# Altium project 150W Studio Light.PrjPcb
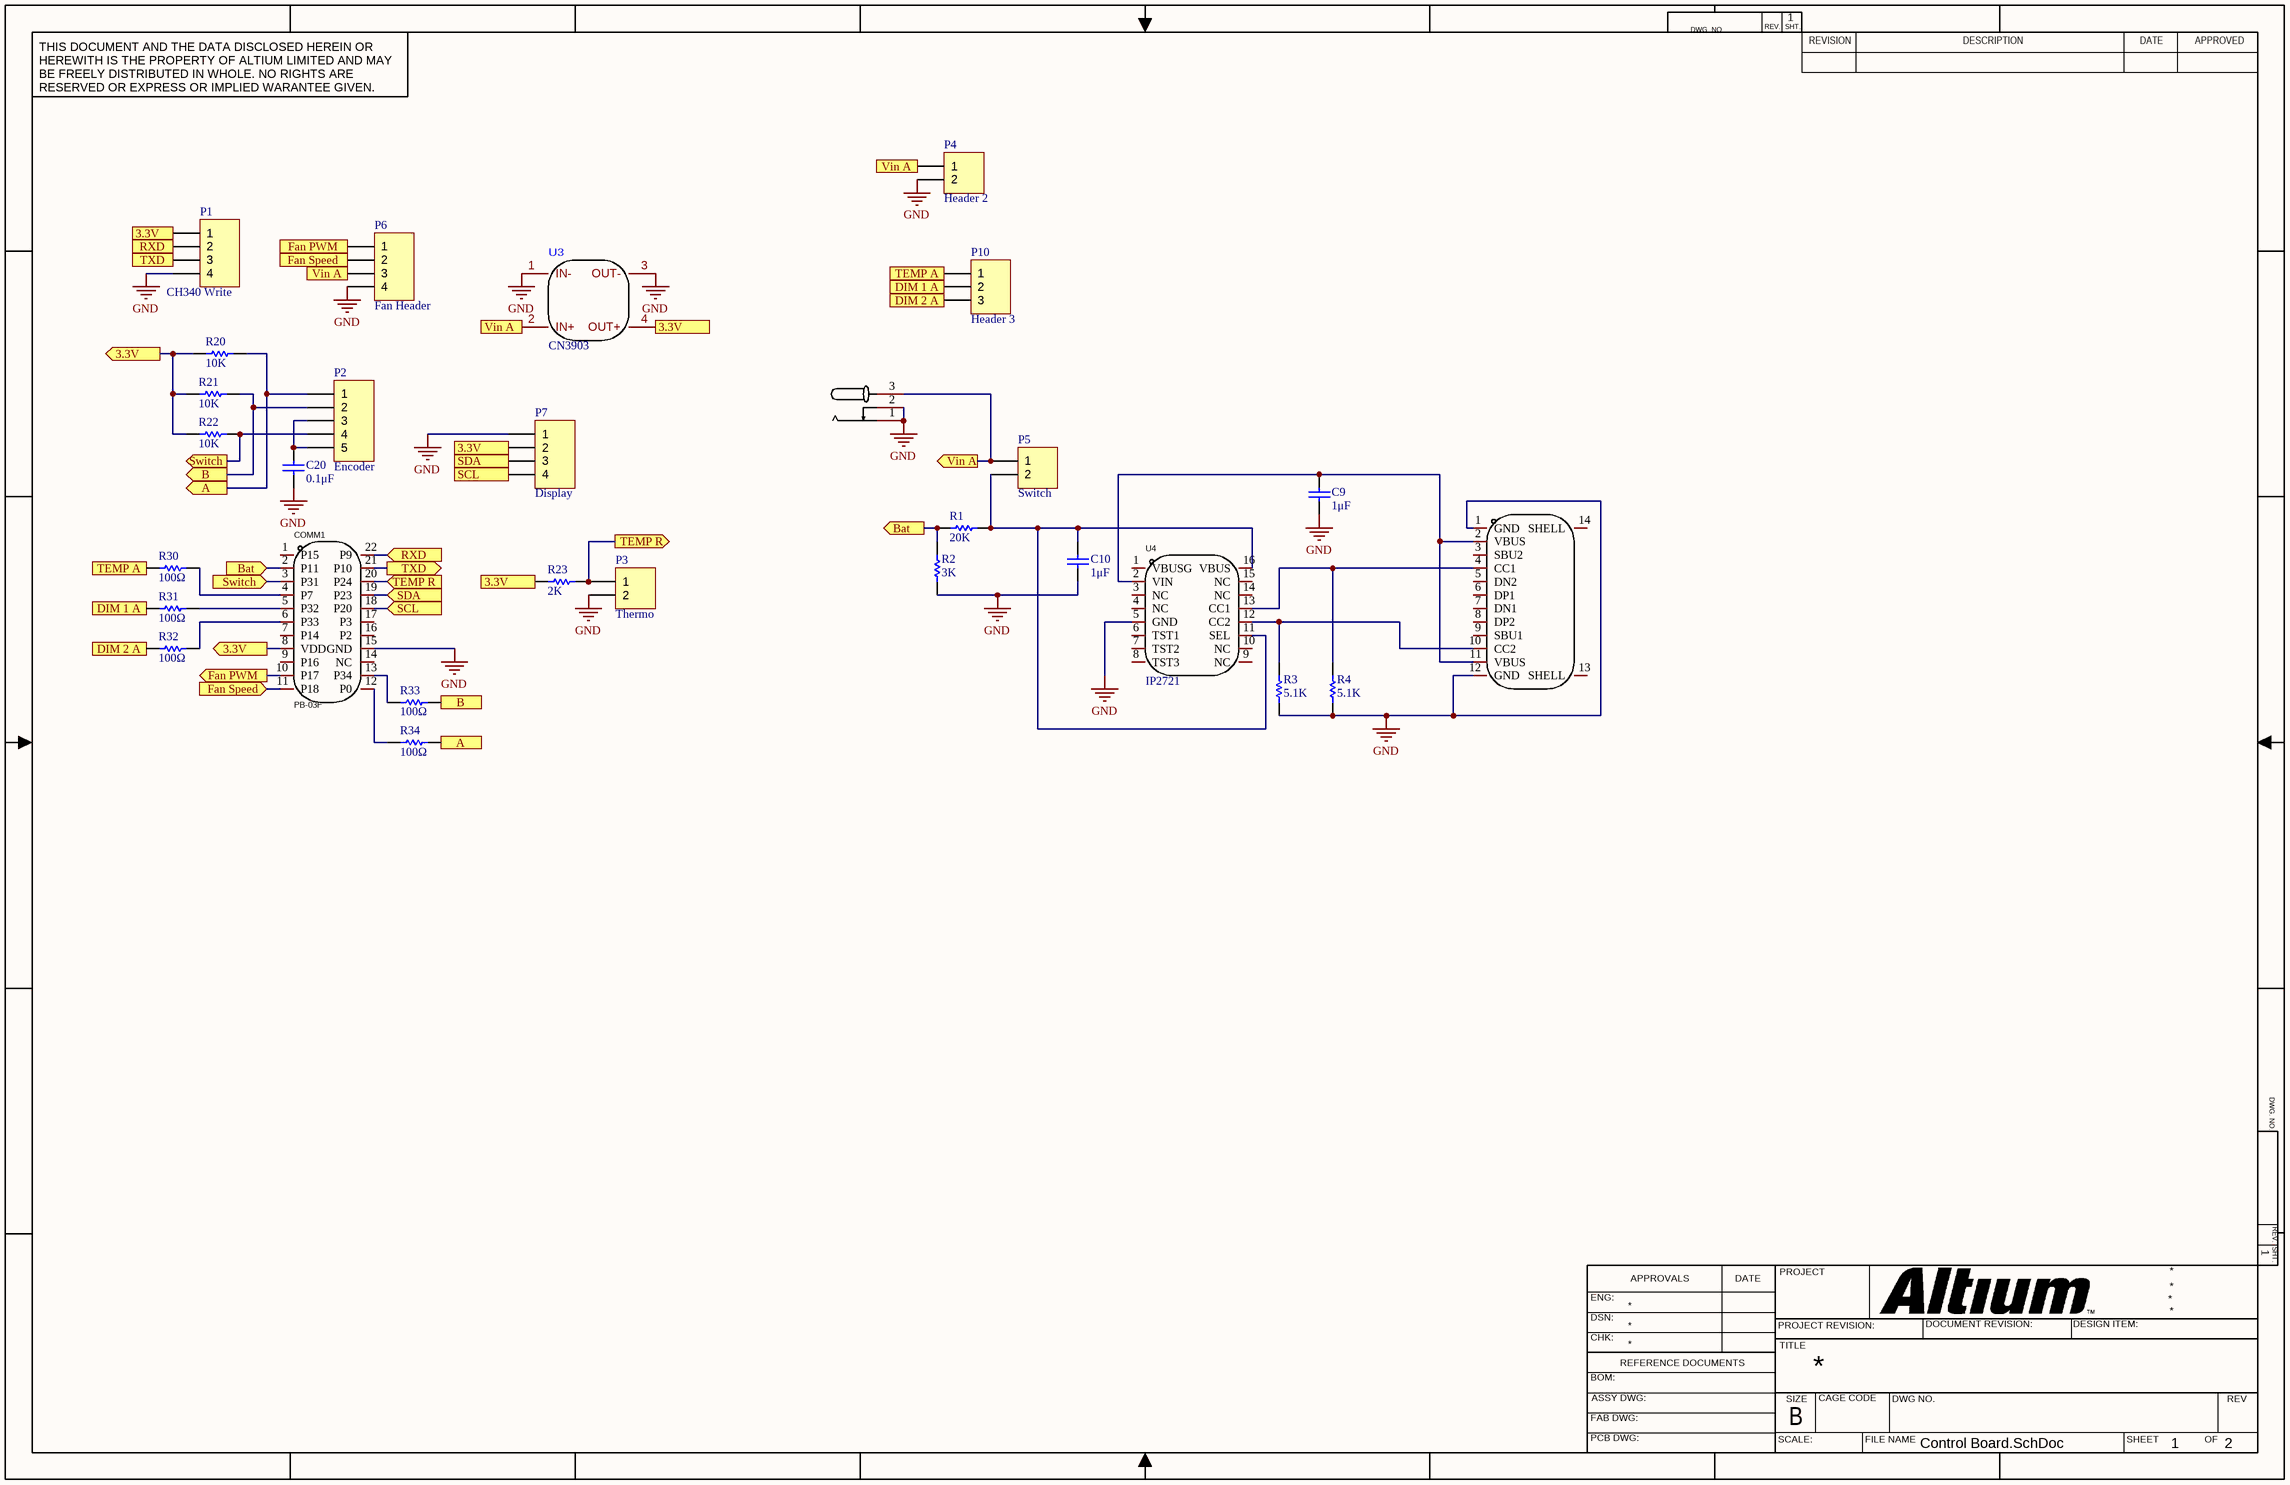
[diagram p0: Control Board.SchDoc]
2 sheets, 75 parts. Net scope: flat (ports and power ports of the same name join across sheets).
Board files: Control Board.PcbDoc, DualLEDDriver.PcbDoc
Sheets:
  Control Board.SchDoc
  DualLEDDriver.SchDoc

## Sheet Control Board.SchDoc
size 431 x 279 mm; SheetNumber: 1; SheetTotal: 2; SPICEModelCacheDHLYHQXB: <root> / <DocumentId>DHLYHQXB</DocumentId> / <CacheFrame Number="0"> / <Model Name="cap" Kind="MDL"> / <Text>*Default semiconductor capacitor / .MODEL CAP C()</Text> / </Model> / </CacheFrame> / </root>

### Parts
C9  value 1μF  [C0805]  (hidden comment: Cap)
C10  value 1μF  [C0805]  (hidden comment: Cap)
C20  value 0.1μF  [C0805]  (hidden comment: Cap)
COMM1  PB-03F  [BULETM-SMD_PB-03F]
DC1  DC-042C-Z-2.5-A  [DC-IN-TH_DC-042C-Z-2.5-A]  (value not drawn)
P1  CH340 Write  [HDR1X4]
P2  Encoder  [HDR1X5]
P3  Thermo  [HDR1X2]
P4  Header 2  [HDR1X2]
P5  Switch  [HDR1X2]
P6  Fan Header  [HDR1X4]
P7  Display  [HDR1X4]
P10  Header 3  [HDR1X3]
R1  value 20K  [C0805]  (hidden comment: Res1)
R2  value 3K  [C0805]  (hidden comment: Res1)
R3  value 5.1K  [C0805]  (hidden comment: Res1)
R4  value 5.1K  [C0805]  (hidden comment: Res1)
R20  value 10K  [C0805]  (hidden comment: Res1)
R21  value 10K  [C0805]  (hidden comment: Res1)
R22  value 10K  [C0805]  (hidden comment: Res1)
R23  value 2K  [C0805]  (hidden comment: Res1)
R30  value 100Ω  [C0805]  (hidden comment: Res1)
R31  value 100Ω  [C0805]  (hidden comment: Res1)
R32  value 100Ω  [C0805]  (hidden comment: Res1)
R33  value 100Ω  [C0805]  (hidden comment: Res1)
R34  value 100Ω  [C0805]  (hidden comment: Res1)
U3  Device: CN3903  [PCBComponent_1 - duplicate]
U4  IP2721  [TSSOP-16_L5.0-W4.4-P0.65-LS6.4-BL]
USB1  TYPE-C 16PIN 2MD(073)  [USB-C-SMD_TYPE-C-6PIN-2MD-073]  (value not drawn)

### Ports
3.3V (out), A (in), A (out), B (in), B (out), Bat (in), Bat (out), DIM 1 A (in), DIM 1 A (out), DIM 2 A (in), DIM 2 A (out), Fan PWM (in), Fan PWM (out), Fan Speed (in), Fan Speed (out), RXD (in), RXD (out), SCL (in), SCL (out), SDA (in), SDA (out), Switch (in), Switch (out), TEMP A (in), TEMP A (out), TEMP R (in), TEMP R (out), TXD (in), TXD (out), Vin A (in), Vin A (out)

### Nets
GND: C9.2 C10.2 C20.1 COMM1.15(GND) DC1.1 DC1.2 P1.4 P3.2 P4.2 P6.4 P7.1 R2.1 R3.2 R4.2 U3.1(IN-) U3.3(OUT-) U4.5(GND) USB1.1(GND) USB1.12(GND)
NetC9_1: C9.1 U4.2(VIN) USB1.2(VBUS) USB1.11(VBUS)
NetC10_1: C10.1 P5.2 R1.2 U4.11(SEL) U4.16(VBUS)
NetC20_2: C20.2 P2.3 P2.5
NetCOMM1_2: COMM1.2(P11) R1.1 R2.2 ; port Bat
NetCOMM1_3: COMM1.3(P31) P2.4 R22.2 ; port Switch
NetCOMM1_4: COMM1.4(P7) R30.2
NetCOMM1_5: COMM1.5(P32) R31.2
NetCOMM1_6: COMM1.6(P33) R32.2
NetCOMM1_8: COMM1.8(VDD) P1.1 P7.2 R20.1 R21.1 R22.1 R23.2 U3.4(OUT+) ; port 3.3V
NetCOMM1_10: COMM1.10(P17) P6.1 ; port Fan PWM
NetCOMM1_11: COMM1.11(P18) P6.2 ; port Fan Speed
NetCOMM1_12: COMM1.12(P0) R34.1
NetCOMM1_13: COMM1.13(P34) R33.1
NetCOMM1_18: COMM1.18(P20) P7.4 ; port SCL
NetCOMM1_19: COMM1.19(P23) P7.3 ; port SDA
NetCOMM1_20: COMM1.20(P24) P3.1 R23.1 ; port TEMP R
NetCOMM1_21: COMM1.21(P10) P1.3 ; port TXD
NetCOMM1_22: COMM1.22(P9) P1.2 ; port RXD
NetDC1_3: DC1.3 P4.1 P5.1 P6.3 U3.2(IN+) ; port Vin A
NetP2_1: P2.1 R20.2 R34.2 ; port A
NetP2_2: P2.2 R21.2 R33.2 ; port B
NetP10_1: P10.1 R30.1 ; port TEMP A
NetP10_2: P10.2 R31.1 ; port DIM 1 A
NetP10_3: P10.3 R32.1 ; port DIM 2 A
NetR3_1: R3.1 U4.12(CC2) USB1.10(CC2)
NetR4_1: R4.1 U4.13(CC1) USB1.4(CC1)

Not connected (* = marked no-connect by the designer): COMM1 1(P15) 7(P14) 9(P16) 14(NC) 16(P2) 17(P3); U4 1(VBUSG) 3(NC) 4(NC) 6(TST1) 7(TST2) 8(TST3) 9(NC) 10(NC) 14(NC) 15(NC); USB1 3(SBU2) 5(DN2) 6(DP1) 7(DN1) 8(DP2) 9(SBU1) 13(SHELL) 14(SHELL)

### Notes on the sheet
- DWG. NO.
- REV.
- SHT.
- THIS DOCUMENT AND THE DATA DISCLOSED HEREIN OR HEREWITH IS THE PROPERTY OF ALTIUM LIMITED AND MAY BE FREELY DISTRIBUTED IN WHOLE. NO RIGHTS ARE RESERVED OR EXPRESS OR IMPLIED WARANTEE GIVEN.
- REVISION
- DESCRIPTION
- DATE
- APPROVED
- ENG:
- APPROVALS
- PROJECT
- DSN:
- CHK:
- REFERENCE DOCUMENTS
- PROJECT REVISION:
- TITLE
- DOCUMENT REVISION:
- DESIGN ITEM:
- BOM:
- FAB DWG:
- PCB DWG:
- ASSY DWG:
- SCALE:
- SIZE
- B
- CAGE CODE
- FILE NAME
- DWG NO.
- SHEET
- OF
- REV

### Library data of the parts
C9 C10 C20 = Cap: Capacitor; Published: 8-Jun-2000; LatestRevisionDate: 17-Jul-2002; LatestRevisionNote: Re-released for DXP Platform.; PackageReference: RAD-0.3; Publisher: Altium Limited; PackageDescription: Radial Cap, Thru-Hole; 2 Leads; 0.3 in Pin Spacing
COMM1 = PB-03F: Manufacturer: Ai-Thinker(安信可); Add into BOM: yes; Symbol: PB-03F; Device: PB-03F; Supplier: LCSC; Supplier Part: c; Manufacturer Part: PB-03F; JLCPCB Part Class: Extended Part; LCSC Part Name: PB-03F; Supplier Footprint: SMD,16x24mm; Datasheet: https://atta.szlcsc.com/upload/public/pdf/source/20220707/D814A4298A3D5539355587756A11D322.pdf; Convert to PCB: yes
DC1 = DC-042C-Z-2.5-A: Manufacturer: XKB Connectivity(中国星坤); Add into BOM: yes; Connector Type: DC电源插座; Inside Contact Diameter: 2.5mm; Outside Contact Diameter: 6mm; Current Rating (Max): 10A; Voltage Rating (Max): 20V; Soldering Temperature(Max): 260℃; Symbol: DC-042C-Z-2.5-A; Device: DC-042C-Z-2.5-A; LCSC Part Name: DC电源插座 内径:2.5mm 外径:6mm 不带开关; Supplier Part: C706901; Manufacturer Part: DC-042C-Z-2.5-A; Supplier Footprint: 插件; JLCPCB Part Class: Extended Part; Datasheet: https://atta.szlcsc.com/upload/public/pdf/source/20211011/A75ED48B9CCFCCBC07979616CD543B30.pdf; Supplier: LCSC; Convert to PCB: yes; Mounting Style: 弯插; Contact Material: 黄铜; Operating Temperature Range: -20℃~+70℃
P1 P6 P7 = Header 4: Header, 4-Pin; LatestRevisionDate: 17-Jul-2002; LatestRevisionNote: Re-released for DXP Platform.; Publisher: Altium Limited
P2 = Header 5: Header, 5-Pin; LatestRevisionDate: 17-Jul-2002; LatestRevisionNote: Re-released for DXP Platform.; Publisher: Altium Limited
P3-P5 = Header 2: Header, 2-Pin; LatestRevisionDate: 17-Jul-2002; LatestRevisionNote: Re-released for DXP Platform.; Publisher: Altium Limited
P10 = Header 3: Header, 3-Pin; LatestRevisionDate: 17-Jul-2002; LatestRevisionNote: Re-released for DXP Platform.; Publisher: Altium Limited
R1-R4 R20-R23 R30-R34 = Res1: Resistor; Published: 8-Jun-2000; LatestRevisionDate: 17-Jul-2002; LatestRevisionNote: Re-released for DXP Platform.; PackageReference: AXIAL-0.3; Publisher: Altium Limited; PackageDescription: Axial Device, Thru-Hole; 2 Leads; 0.3 in Pin Spacing
U3 = CN3903模块
U4 = IP2721: Manufacturer: INJOINIC(英集芯); Add into BOM: yes; Symbol: IP2721; Device: IP2721; LCSC Part Name: IP2721; Supplier Part: C603176; Manufacturer Part: IP2721; Supplier Footprint: TSSOP-16; JLCPCB Part Class: Extended Part; Datasheet: https://atta.szlcsc.com/upload/public/pdf/source/20200610/C603176_729C2C55A9E6451BDA9FCB913350E23E.pdf; Supplier: LCSC; Convert to PCB: yes
USB1 = TYPE-C 16PIN 2MD(073): Manufacturer: SHOU HAN(首韩); Add into BOM: yes; Gender: 母; Number of Ports: 1; Number of Contacts: 16P; Current Rating - Power (Max): 5A; Symbol: TYPE-C 16PIN 2MD(073); Device: TYPE-C 16PIN 2MD(073); Supplier: LCSC; Supplier Part: C2765186; Manufacturer Part: TYPE-C 16PIN 2MD(073); JLCPCB Part Class: Extended Part; LCSC Part Name: Type-C 母 卧贴; Supplier Footprint: SMD; Datasheet: https://atta.szlcsc.com/upload/public/pdf/source/20211123/39B17C16241EAC15C5E277BDA434118E.pdf; Convert to PCB: yes; Connector Type: Type-C; Standard: -; Mounting Style: 卧贴; Operating Temperature Range: -25℃~+85℃

## Sheet DualLEDDriver.SchDoc
size A; SheetNumber: 2; SheetTotal: 2; SPICEModelCacheRFRFCTWC: <root> / <DocumentId>RFRFCTWC</DocumentId> / <CacheFrame Number="0"> / <Model Name="cap" Kind="MDL"> / <Text>*Default semiconductor capacitor / .MODEL CAP C()</Text> / </Model> / </CacheFrame> / </root>
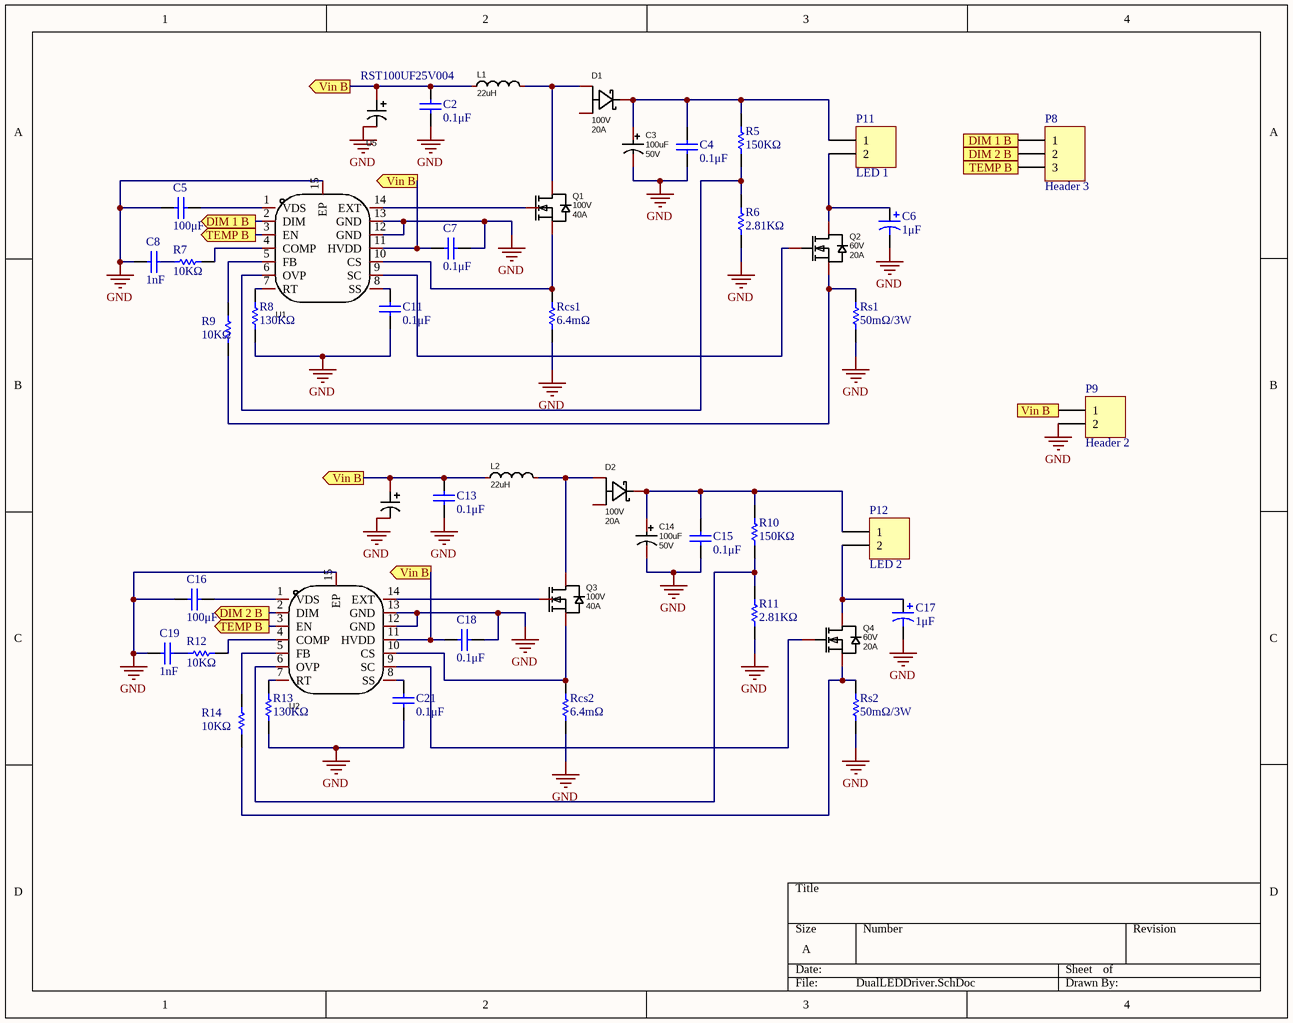
[diagram p1: DualLEDDriver.SchDoc]

### Parts
C2  value 0.1μF  [C0805]  (hidden comment: Cap)
C3  value 100uF  Rated Voltage: 50V  [CAP-TH_BD8.0-P3.50-D0.6-FD]  (hidden comment: KM107M050F12RR0VH2FP0)
C4  value 0.1μF  [C0805]  (hidden comment: Cap)
C5  value 100μF  [C0805]  (hidden comment: Cap)
C6  value 1μF  [C0805]  (hidden comment: Cap Pol3)
C7  value 0.1μF  [C0805]  (hidden comment: Cap)
C8  value 1nF  [C0805]  (hidden comment: Cap)
C11  value 0.1μF  [C0805]  (hidden comment: Cap)
C13  value 0.1μF  [C0805]  (hidden comment: Cap)
C14  value 100uF  Rated Voltage: 50V  [CAP-TH_BD8.0-P3.50-D0.6-FD]  (hidden comment: KM107M050F12RR0VH2FP0)
C15  value 0.1μF  [C0805]  (hidden comment: Cap)
C16  value 100μF  [C0805]  (hidden comment: Cap)
C17  value 1μF  [C0805]  (hidden comment: Cap Pol3)
C18  value 0.1μF  [C0805]  (hidden comment: Cap)
C19  value 1nF  [C0805]  (hidden comment: Cap)
C21  value 0.1μF  [C0805]  (hidden comment: Cap)
D1  Reverse Voltage (Vr): 100V  Average Rectified Current (Io): 20A  [TO-277_3P-L5.7-W4.2-LS6.5-BR]  (hidden comment: ST20100L)
D2  Reverse Voltage (Vr): 100V  Average Rectified Current (Io): 20A  [TO-277_3P-L5.7-W4.2-LS6.5-BR]  (hidden comment: ST20100L)
L1  value 22uH  [IND-SMD_L16.5-W15.5]  (hidden comment: FEXL1513A-220M)
L2  value 22uH  [IND-SMD_L16.5-W15.5]  (hidden comment: FEXL1513A-220M)
P8  Header 3  [HDR1X3]
P9  Header 2  [HDR1X2]
P11  LED 1  [HDR1X2]
P12  LED 2  [HDR1X2]
Q1  Drain Source Voltage (Vdss): 100V  Continuous Drain Current (Id): 40A  [TO-252-2_L6.6-W6.1-P4.58-LS9.9-TL]  (hidden comment: AP40T10GH-VB)
Q2  Drain Source Voltage (Vdss): 60V  Continuous Drain Current (Id): 20A  [TO-252-2_L6.6-W6.1-P4.57-LS10.1-TL-CW]  (hidden comment: NCE6020AK)
Q3  Drain Source Voltage (Vdss): 100V  Continuous Drain Current (Id): 40A  [TO-252-2_L6.6-W6.1-P4.58-LS9.9-TL]  (hidden comment: AP40T10GH-VB)
Q4  Drain Source Voltage (Vdss): 60V  Continuous Drain Current (Id): 20A  [TO-252-2_L6.6-W6.1-P4.57-LS10.1-TL-CW]  (hidden comment: NCE6020AK)
R5  value 150KΩ  [C0805]  (hidden comment: Res1)
R6  value 2.81KΩ  [C0805]  (hidden comment: Res1)
R7  value 10KΩ  [C0805]  (hidden comment: Res1)
R8  value 130KΩ  [C0805]  (hidden comment: Res1)
R9  value 10KΩ  [C0805]  (hidden comment: Res1)
R10  value 150KΩ  [C0805]  (hidden comment: Res1)
R11  value 2.81KΩ  [C0805]  (hidden comment: Res1)
R12  value 10KΩ  [C0805]  (hidden comment: Res1)
R13  value 130KΩ  [C0805]  (hidden comment: Res1)
R14  value 10KΩ  [C0805]  (hidden comment: Res1)
Rcs1  value 6.4mΩ  [C0805]  (hidden comment: Res1)
Rcs2  value 6.4mΩ  [C0805]  (hidden comment: Res1)
Rs1  value 50mΩ/3W  [C2512]  (hidden comment: Res1)
Rs2  value 50mΩ/3W  [C2512]  (hidden comment: Res1)
U1  FP7209mR-G1  [TSSOP-14_L5.0-W4.4-P0.65-LS6.4-BL-EP]  (value not drawn)
U2  FP7209mR-G1  [TSSOP-14_L5.0-W4.4-P0.65-LS6.4-BL-EP]  (value not drawn)
U5  RST100UF25V004  [CAP-SMD_BD6.3-L6.6-W6.6-LS7.3-FD]
U6  RST100UF25V004  [CAP-SMD_BD6.3-L6.6-W6.6-LS7.3-FD]  (value not drawn)

### Ports
DIM 1 B (in), DIM 1 B (out), DIM 2 B (in), DIM 2 B (out), TEMP B (in), TEMP B (out), Vin B (out)

### Nets
GND: C2.1 C3.2 C4.1 C5.2 C6.2 C7.1 C8.2 C11.1 C13.1 C14.2 C15.1 C16.2 C17.2 C18.1 C19.2 C21.1 P9.2 R6.2 R8.1 R11.2 R13.1 Rcs1.1 Rcs2.1 Rs1.1 Rs2.1 U1.12(GND) U1.13(GND) U1.15(EP) U2.12(GND) U2.13(GND) U2.15(EP) U5.2 U6.2
NetC2_2: C2.2 C7.2 C13.2 C18.2 L1.2 L2.2 P9.1 U1.11(HVDD) U2.11(HVDD) U5.1 U6.1 ; port Vin B
NetC3_1: C3.1 C4.2 D1.2(K) P11.1 R5.2
NetC5_1: C5.1 U1.1(VDS)
NetC6_1: C6.1 P11.2 Q2.2(D)
NetC8_1: C8.1 R7.1
NetC11_2: C11.2 U1.8(SS)
NetC14_1: C14.1 C15.2 D2.2(K) P12.1 R10.2
NetC16_1: C16.1 U2.1(VDS)
NetC17_1: C17.1 P12.2 Q4.2(D)
NetC19_1: C19.1 R12.1
NetC21_2: C21.2 U2.8(SS)
NetD1_1: D1.1(A) L1.1 Q1.2(D)
NetD2_1: D2.1(A) L2.1 Q3.2(D)
NetP8_1: P8.1 U1.2(DIM) ; port DIM 1 B
NetP8_2: P8.2 U2.2(DIM) ; port DIM 2 B
NetP8_3: P8.3 U1.3(EN) U2.3(EN) ; port TEMP B
NetQ1_1: Q1.1(G) U1.14(EXT)
NetQ1_3: Q1.3(S) Rcs1.2 U1.10(CS)
NetQ2_1: Q2.1(G) U1.9(SC)
NetQ2_3: Q2.3(S) R9.1 Rs1.2
NetQ3_1: Q3.1(G) U2.14(EXT)
NetQ3_3: Q3.3(S) Rcs2.2 U2.10(CS)
NetQ4_1: Q4.1(G) U2.9(SC)
NetQ4_3: Q4.3(S) R14.1 Rs2.2
NetR5_1: R5.1 R6.1 U1.6(OVP)
NetR7_2: R7.2 U1.4(COMP)
NetR8_2: R8.2 U1.7(RT)
NetR9_2: R9.2 U1.5(FB)
NetR10_1: R10.1 R11.1 U2.6(OVP)
NetR12_2: R12.2 U2.4(COMP)
NetR13_2: R13.2 U2.7(RT)
NetR14_2: R14.2 U2.5(FB)

Not connected (* = marked no-connect by the designer): D1 3(A); D2 3(A)

### Library data of the parts
C2 C4 C5 C7 C8 C11 C13 C15 C16 C18 C19 C21 = Cap: Capacitor; Published: 8-Jun-2000; LatestRevisionDate: 17-Jul-2002; LatestRevisionNote: Re-released for DXP Platform.; PackageReference: RAD-0.3; Publisher: Altium Limited; PackageDescription: Radial Cap, Thru-Hole; 2 Leads; 0.3 in Pin Spacing
C3 C14 = KM107M050F12RR0VH2FP0: Manufacturer: CX(承兴); Symbol: 50V 100uF 8X12; Add into BOM: yes; Tolerance: ±20%; φD: 8mm; L: 12mm; Lifetime @ Temp: 2000hrs@105℃; Device: KM107M050F12RR0VH2FP0; LCSC Part Name: 100uF ±20% 50V; Supplier Part: C2749; Manufacturer Part: KM107M050F12RR0VH2FP0; Supplier Footprint: 插件,D8xL12mm; JLCPCB Part Class: Extended Part; Datasheet: https://atta.szlcsc.com/upload/public/pdf/source/20211027/06D6BA3719C264B639DC286D935D03EA.pdf; Supplier: LCSC; Convert to PCB: yes; Lead Spacing: 3.5mm
C6 C17 = Cap Pol3: Polarized Capacitor (Surface Mount); Published: 8-Jun-2000; LatestRevisionDate: 29-May-2009; LatestRevisionNote: IPC-7351 Footprint Added.; PackageReference: C0805; Publisher: Altium Limited; PackageDescription: Chip Capacitor
D1 D2 = ST20100L: Manufacturer: CJ(江苏长电/长晶); Add into BOM: yes; Diode Configuration: 独立式; Forward Voltage (Vf@If): 650mV@20A; Reverse Leakage Current (Ir): 30uA@100V; Symbol: ST20100L; Device: ST20100L; LCSC Part Name: 电压:100V 电流:20A; Supplier Part: C2693410; Manufacturer Part: ST20100L; Supplier Footprint: TO-277; JLCPCB Part Class: Extended Part; Datasheet: https://atta.szlcsc.com/upload/public/pdf/source/20210330/C2693410_9551F5ED840A67394421895091158B3C.pdf; Supplier: LCSC; Convert to PCB: yes
L1 L2 = FEXL1513A-220M: Manufacturer: cjiang(长江微电); Add into BOM: yes; Tolerance: ±20%; Rated Current: 17A; Saturation Current (Isat): 22A; DC Resistance (DCR): 13.86mΩ; Type: 一体成型电感; Symbol: FEXL1513A-220M; Device: FEXL1513A-220M; LCSC Part Name: 22uH ±20% 22A; Supplier Part: C5378604; Manufacturer Part: FEXL1513A-220M; Supplier Footprint: SMD,16.5x15.5x12.7mm(1513); JLCPCB Part Class: Extended Part; Datasheet: https://atta.szlcsc.com/upload/public/pdf/source/20230406/FF57C09F52BFC355BADE8D0321BD05F5.pdf; Supplier: LCSC; Convert to PCB: yes; Ratings: AEC-Q200
P8 = Header 3: Header, 3-Pin; LatestRevisionDate: 17-Jul-2002; LatestRevisionNote: Re-released for DXP Platform.; Publisher: Altium Limited
P9 P11 P12 = Header 2: Header, 2-Pin; LatestRevisionDate: 17-Jul-2002; LatestRevisionNote: Re-released for DXP Platform.; Publisher: Altium Limited
Q1 Q3 = AP40T10GH-VB: Manufacturer: VBsemi(微碧半导体); Add into BOM: yes; Type: N沟道; Drain Source On Resistance (RDS(on)@Vgs,Id): 30mΩ@10V,40A; Symbol: AP40T10GH; Device: AP40T10GH-VB; LCSC Part Name: N沟道 耐压:100V 电流:40A; Supplier Part: C693118; Manufacturer Part: AP40T10GH-VB; Supplier Footprint: TO-252-2; JLCPCB Part Class: Extended Part; Datasheet: https://atta.szlcsc.com/upload/public/pdf/source/20230505/1A0FD829F773C85C90E545D17A9CBDF0.pdf; Supplier: LCSC; Convert to PCB: yes; Power Dissipation (Pd): -; Gate Threshold Voltage (Vgs(th)@Id): -; Total Gate Charge (Qg@Vgs): -; Input Capacitance (Ciss@Vds): -; Reverse Transfer Capacitance (Crss@Vds): -
Q2 Q4 = NCE6020AK: Manufacturer: NCE(无锡新洁能); Add into BOM: yes; Type: N沟道; Power Dissipation (Pd): 45W; Drain Source On Resistance (RDS(on)@Vgs,Id): 35mΩ@10V,20A; Gate Threshold Voltage (Vgs(th)@Id): 2.5V@250uA; Symbol: NCE6020AK; Device: NCE6020AK; LCSC Part Name: N沟道 耐压:60V 电流:20A; Supplier Part: C108639; Manufacturer Part: NCE6020AK; Supplier Footprint: TO-252-2(DPAK); JLCPCB Part Class: Extended Part; Datasheet: https://atta.szlcsc.com/upload/public/pdf/source/20231201/F7F8CF8E769EE35C01C69D8E45471040.pdf; Supplier: LCSC; Convert to PCB: yes
R5-R14 Rcs1 Rcs2 Rs1 Rs2 = Res1: Resistor; Published: 8-Jun-2000; LatestRevisionDate: 17-Jul-2002; LatestRevisionNote: Re-released for DXP Platform.; PackageReference: AXIAL-0.3; Publisher: Altium Limited; PackageDescription: Axial Device, Thru-Hole; 2 Leads; 0.3 in Pin Spacing
U1 U2 = FP7209mR-G1: Manufacturer: Advanced Analog Technology(类比); Add into BOM: yes; Symbol: FP7209MR-G1; Device: FP7209mR-G1; LCSC Part Name: FP7209mR-G1; Supplier Part: C2762848; Manufacturer Part: FP7209mR-G1; Supplier Footprint: TSSOP-14-EP; JLCPCB Part Class: Extended Part; Datasheet: https://atta.szlcsc.com/upload/public/pdf/source/20210915/BA17F30BBB4CEE378D5F258F3F58057A.pdf; Supplier: LCSC; Convert to PCB: yes
U5 U6 = RST100UF25V004: Manufacturer: KNSCHA(科尼盛); Add into BOM: yes; Value: 100uF; Tolerance: ±20%; Rated Voltage: 25V; Ripple Current: 88mA@120Hz; φD: 6.3mm; L: 5.4mm; Lifetime @ Temp: 2000hrs@105℃; Symbol: RST100UF25V004; Device: RST100UF25V004; LCSC Part Name: 100uF ±20% 25V; Supplier Part: C4747964; Manufacturer Part: RST100UF25V004; Supplier Footprint: SMD,D6.3xL5.4mm; JLCPCB Part Class: Extended Part; Datasheet: https://atta.szlcsc.com/upload/public/pdf/source/20220722/52F6C209ACF875FF59C64C72CE2329EE.pdf; Supplier: LCSC; Convert to PCB: yes; Equivalent Series Resistance(ESR): -; Operating Temperature: -40℃~+105℃

## Nets that join several sheets
GND: Control Board (19 pins), DualLEDDriver (33 pins)